# EAGLE schematic oshpark2.1 (EAGLE 6.6.0)
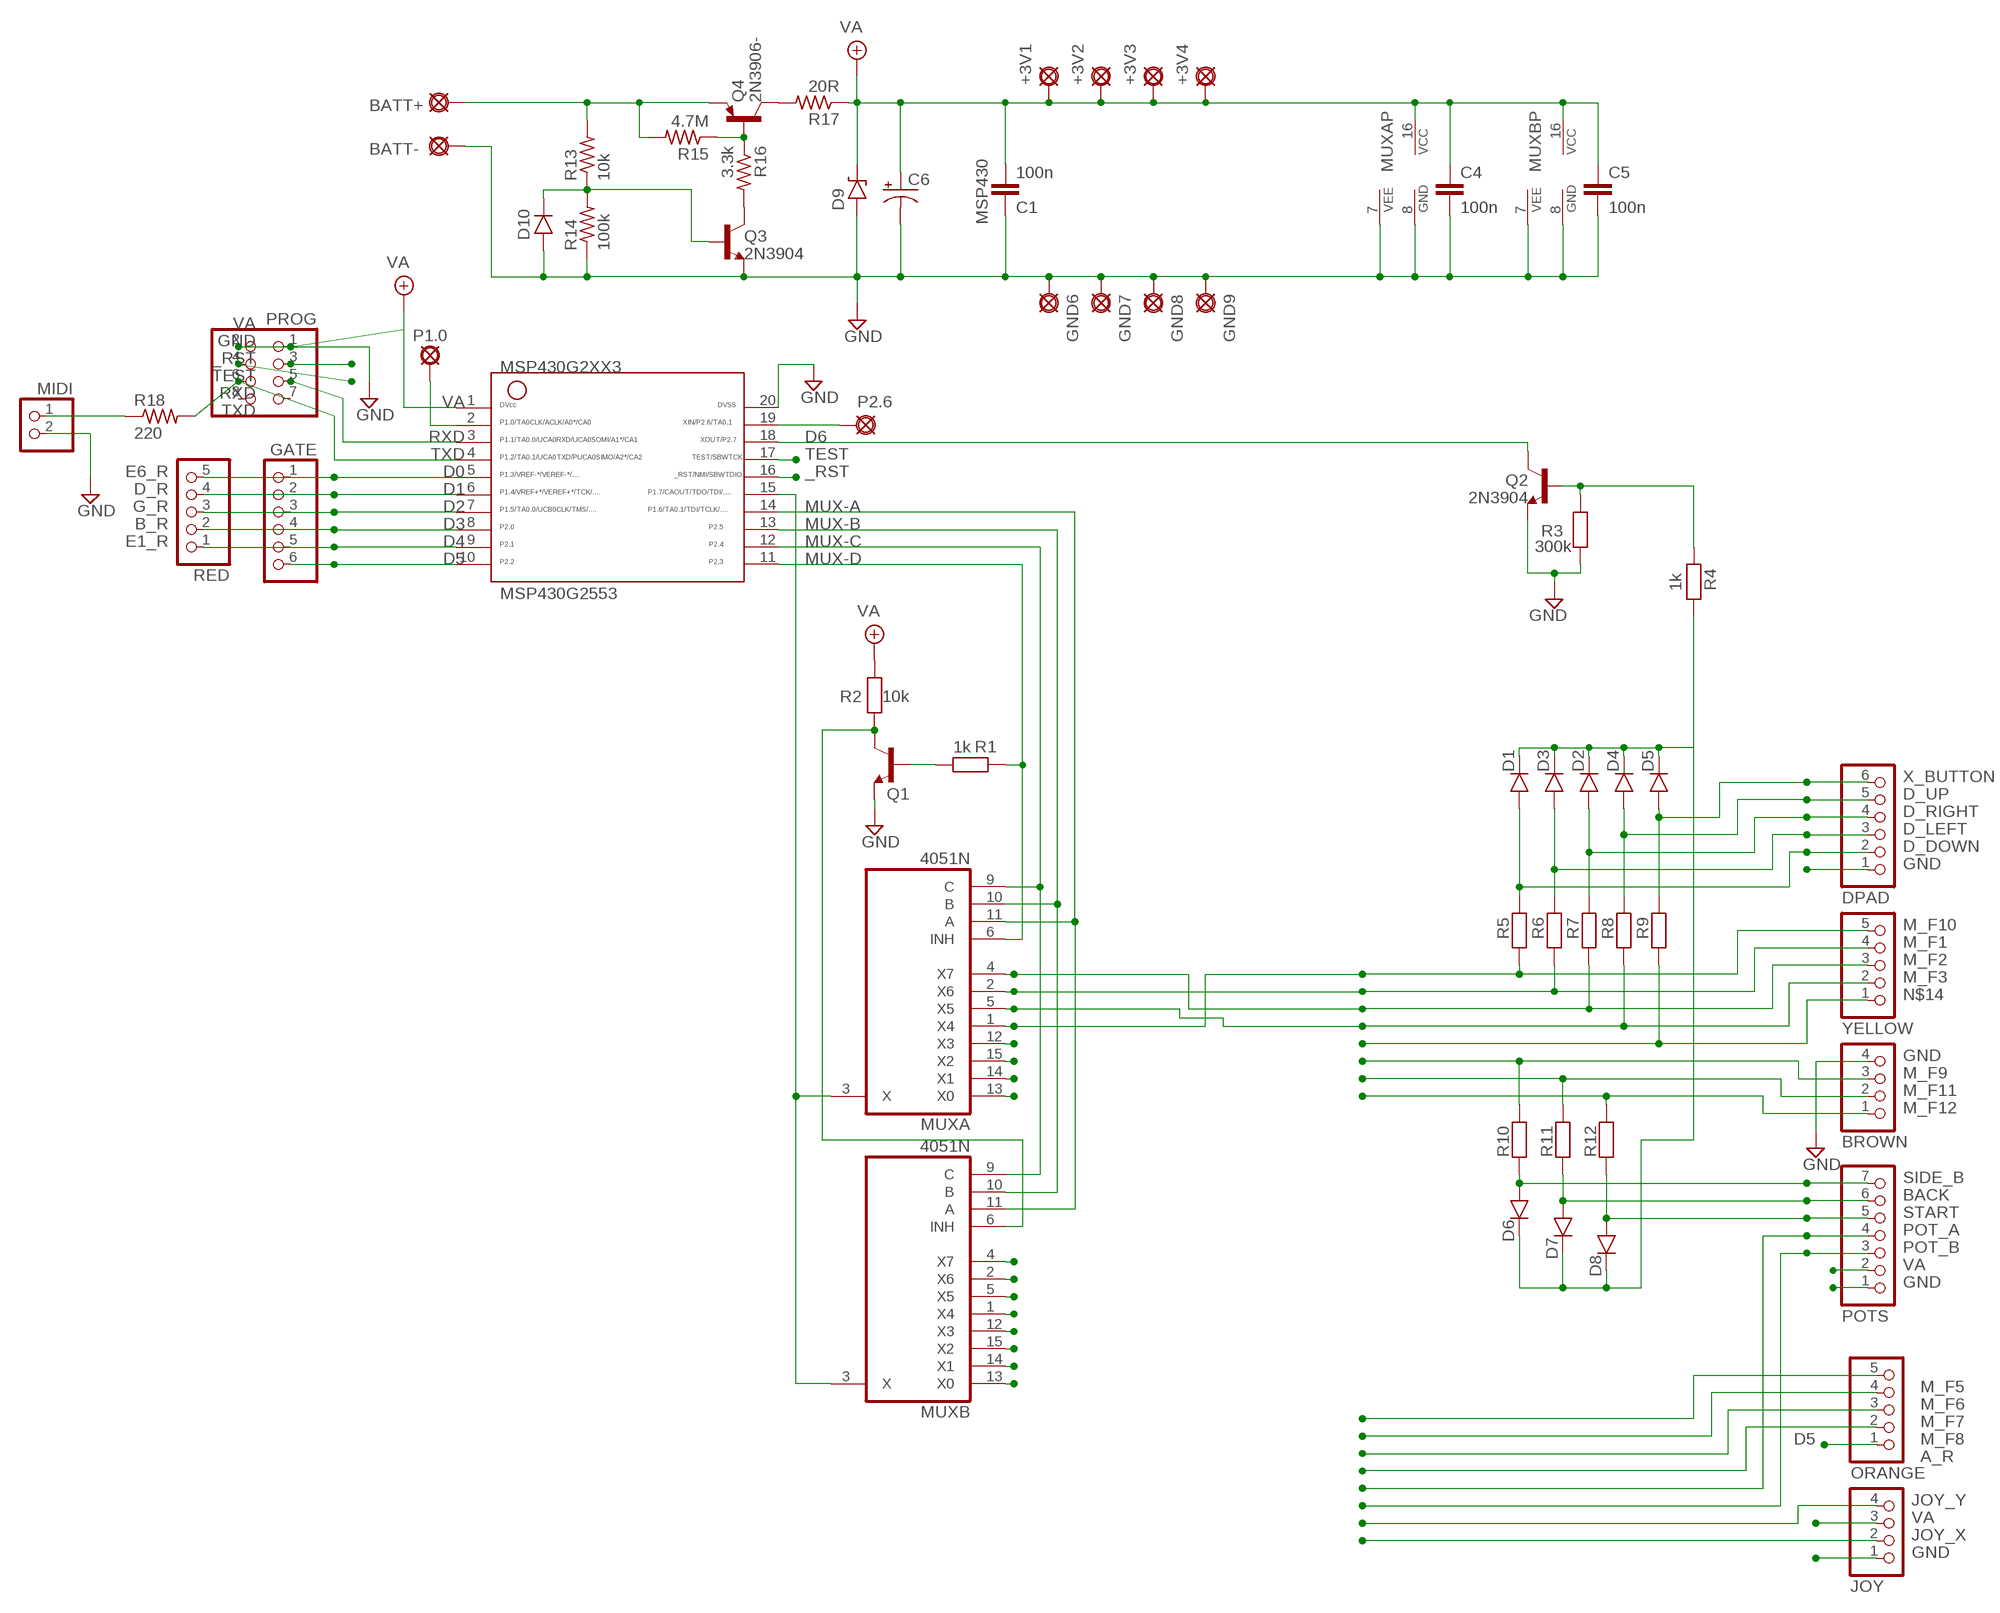
[diagram p0: schematic, sheet 1]

## Parts
+3V1  PAD8  [OCTOGON]
+3V2  PAD8  [OCTOGON]
+3V3  PAD8  [OCTOGON]
+3V4  PAD8  [OCTOGON]
BATT+  PADL  [LONG]
BATT-  PADL  [LONG]
BROWN  PINHD-1X4  [1X04]
C1  100n  050X030_050  [050X030_050_3]
C4  100n  050X030_050  [050X030_050_3]
C5  100n  050X030_050  [050X030_050_3]
C6  050  [050_020]
D1  1N4148-2  [DO35-2]
D2  1N4148-2  [DO35-2]
D3  1N4148-2  [DO35-2]
D4  1N4148-2  [DO35-2]
D5  1N4148-2  [DO35-2]
D6  1N4148-2  [DO35-2]
D7  1N4148-2  [DO35-2]
D8  1N4148-2  [DO35-2]
D9  1N9ZENER  [DO35-3]
D10  1N4148-2  [DO35-2]
DPAD  PINHD-1X6  [1X06]
GATE  PINHD-1X6  [1X06]
GND6  PAD  [SQUARE]
GND7  PAD  [SQUARE]
GND8  PAD  [SQUARE]
GND9  PAD  [SQUARE]
JOY  PINHD-1X4  [1X04]
MIDI  PINHD-1X2  [1X02]
MSP430G2553  G2XX3---N20  [N20]
MUXA  4051N  [DIL16]
MUXB  4051N  [DIL16]
ORANGE  PINHD-1X5  [1X05]
P1.0  PADO  [ROUND]
P2.6  PADO  [ROUND]
POTS  PINHD-1X7  [1X07]
PROG  PINHD-2X4  [2X04]
Q1  2N3904  [TO92-]
Q2  2N3904  [TO92-]
Q3  2N3904  [TO92-]
Q4  2N3906-  [TO92-]
R1  1k  6MM-EU1  [R0207/1V]
R2  10k  6MM-EU1  [R0207/1V]
R3  300k  6MM-EU1  [R0207/1V]
R4  1k  6MM-EU  [R0207/3]
R5  30k  6MM-EU1  [R0207/1V]
R6  30k  6MM-EU1  [R0207/1V]
R7  30k  6MM-EU1  [R0207/1V]
R8  30k  6MM-EU1  [R0207/1V]
R9  30k  6MM-EU1  [R0207/1V]
R10  30k  6MM-EU1  [R0207/1V]
R11  30k  6MM-EU1  [R0207/1V]
R12  30k  6MM-EU1  [R0207/1V]
R13  10k  6MM.1  [R0207/1V]
R14  100k  6MM.2  [R0207/2V]
R15  4.7M  6MM.1  [R0207/1V]
R16  3.3k  6MM.1  [R0207/1V]
R17  20R  6MM.1  [R0207/1V]
R18  220  6MM.3  [R0207/3]
RED  PINHD-1X5  [1X05]
YELLOW  PINHD-1X5  [1X05]

## Nets
_RST: MSP430G2553.16 PROG.3
AN_IN: MSP430G2553.15 MUXA.3(X) MUXB.3(X)
BACK: D7.A POTS.6 R11.2
BATT+: BATT+.1(PAD) Q4.3(E) R13.2 R15.2
D0: GATE.1 MSP430G2553.5 RED.5
D1: GATE.2 MSP430G2553.6 RED.4
D2: GATE.3 MSP430G2553.7 RED.3
D3: GATE.4 MSP430G2553.8 RED.2
D4: GATE.5 MSP430G2553.9 RED.1
D5: GATE.6 MSP430G2553.10 ORANGE.1
D6: MSP430G2553.18 Q2.1(C)
D_DOWN: D1.A DPAD.2 R5.2
D_LEFT: D3.A DPAD.3 R6.2
D_RIGHT: D2.A DPAD.4 R7.2
D_UP: D4.A DPAD.5 R8.2
GND: BATT-.1(PAD) BROWN.4 C1.1 C4.2 C5.2 C6.- D9.A D10.A DPAD.1 GND6.1(PAD) GND7.1(PAD) GND8.1(PAD) GND9.1(PAD) JOY.1 MIDI.2 MSP430G2553.20 MUXA.7(VEE) MUXA.8(GND) MUXB.7(VEE) MUXB.8(GND) POTS.1 PROG.2 Q1.3(E) Q2.3(E) Q3.3(E) R3.2 R14.1
JOY_X: JOY.2
JOY_Y: JOY.4
M_F1: MUXA.2(X6) R6.1 YELLOW.4
M_F2: MUXA.4(X7) R7.1 YELLOW.3
M_F3: MUXA.5(X5) R8.1 YELLOW.2
M_F5: ORANGE.5
M_F6: ORANGE.4
M_F7: ORANGE.3
M_F8: ORANGE.2
M_F9: BROWN.3 R10.1
M_F10: MUXA.1(X4) R5.1 YELLOW.5
M_F11: BROWN.2 R11.1
M_F12: BROWN.1 R12.1
MUX-A: MSP430G2553.14 MUXA.11(A) MUXB.11(A)
MUX-B: MSP430G2553.13 MUXA.10(B) MUXB.10(B)
MUX-C: MSP430G2553.12 MUXA.9(C) MUXB.9(C)
MUX-D: MSP430G2553.11 MUXA.6(INH) R1.1
N$1: MIDI.1 R18.1
N$2: MSP430G2553.19 P2.6.1(PAD)
N$3: Q1.2(B) R1.2
N$4: MSP430G2553.2 P1.0.1(PAD)
N$7: Q2.2(B) R3.1 R4.2
N$10: MUXB.2(X6)
N$11: D10.C Q3.2(B) R13.1 R14.2
N$12: MUXA.15(X2)
N$13: MUXA.14(X1)
N$14: R9.1 YELLOW.1
N$15: Q4.2(B) R15.1 R16.1
N$16: MUXA.13(X0)
N$17: Q3.1(C) R16.2
N$19: D1.C D2.C D3.C D4.C D5.C D6.C D7.C D8.C R4.1
N$20: Q4.1(C) R17.2
N$21: MUXB.1(X4)
N$22: MUXB.4(X7)
N$23: MUXB.12(X3)
N$27: MUXB.13(X0)
N$28: MUXB.15(X2)
N$29: MUXB.14(X1)
N$38: MUXA.12(X3)
N$43: MUXB.5(X5)
POT_A: POTS.4
POT_B: POTS.3
RXD: MSP430G2553.3 PROG.5
SIDE_B: D6.A POTS.7 R10.2
START: D8.A POTS.5 R12.2
TEST: MSP430G2553.17 PROG.4
TXD: MSP430G2553.4 PROG.6 R18.2
VA: +3V1.1(PAD) +3V2.1(PAD) +3V3.1(PAD) +3V4.1(PAD) C1.2 C4.1 C5.1 C6.+ D9.C JOY.3 MSP430G2553.1 MUXA.16(VCC) MUXB.16(VCC) POTS.2 PROG.1 R2.2 R17.1
X_BUTTON: D5.A DPAD.6 R9.2
~MUX-D: MUXB.6(INH) Q1.1(C) R2.1
Unconnected: PROG.7 PROG.8

## Notes on the sheet
- MSP430
- E6_R
- D_R
- G_R
- B_R
- E1_R
- A_R

## Library data of the parts
+3V1-+3V4 BATT+ BATT- GND6-GND9 P1.0 P2.6 = gm-supply:PAD: PAD use this package for pads with any purpose, including input, output, send or return various pad shapes: round, square, octogonal, long, and long offset
BROWN JOY = pinhead:PINHD-1X4: PIN HEADER
C1 C4 C5 = gm-caps-ceramic:050X030_050: 120 - 150pF Xicon Ceramic Disc 5mm lead spacing
C6 = gm-caps-electro-pol:050: 0.22 - 100uF Xicon values at Mouser.com: 10V: 10 - 100uF; 16V: 2.2 - 47uF; 25V: 0.47 - 47uF; 50V: 0.22 - 22uF
D1-D8 D10 = gm-diodes:1N4148: Fast Switching Diode DO-35 glass case a.k.a. 1N914
D9 = gm-diodes:1N9*ZENER: 1N9???B Zener Diode DO-35 case 1N957B - 1N992B (6.8V to 200V)
DPAD GATE = pinhead:PINHD-1X6: PIN HEADER
MIDI = pinhead:PINHD-1X2: PIN HEADER
MSP430G2553 = TI_MSP430_v16:G2XX3---N20: MSP430G2XX1 PDIP (N) 20 Pin Package
MUXA MUXB = 40xx:4051: 8-channel ANALOG MULTIPLEXER
ORANGE RED YELLOW = pinhead:PINHD-1X5: PIN HEADER
POTS = pinhead:PINHD-1X7: PIN HEADER
PROG = pinhead:PINHD-2X4: PIN HEADER
Q1-Q3 = gm-trans:2N3904: NPN Transistor
Q4 = gm-trans:2N3906: PNP Transistor
R1-R12 = gm-resistors:6MM-EU: 6mm Resistors (European schematic symbol) Leads spaced 1-6 holes apart for 0.1" perfboard. Suitable for 1/4 watt resistors.
R13-R18 = gm-resistors:6MM: 6mm Resistors Leads spaced 1-6 holes apart for 0.1" perfboard. Suitable for 1/4 watt resistors.